# Altium project HV Box Connector Board.PrjPcb
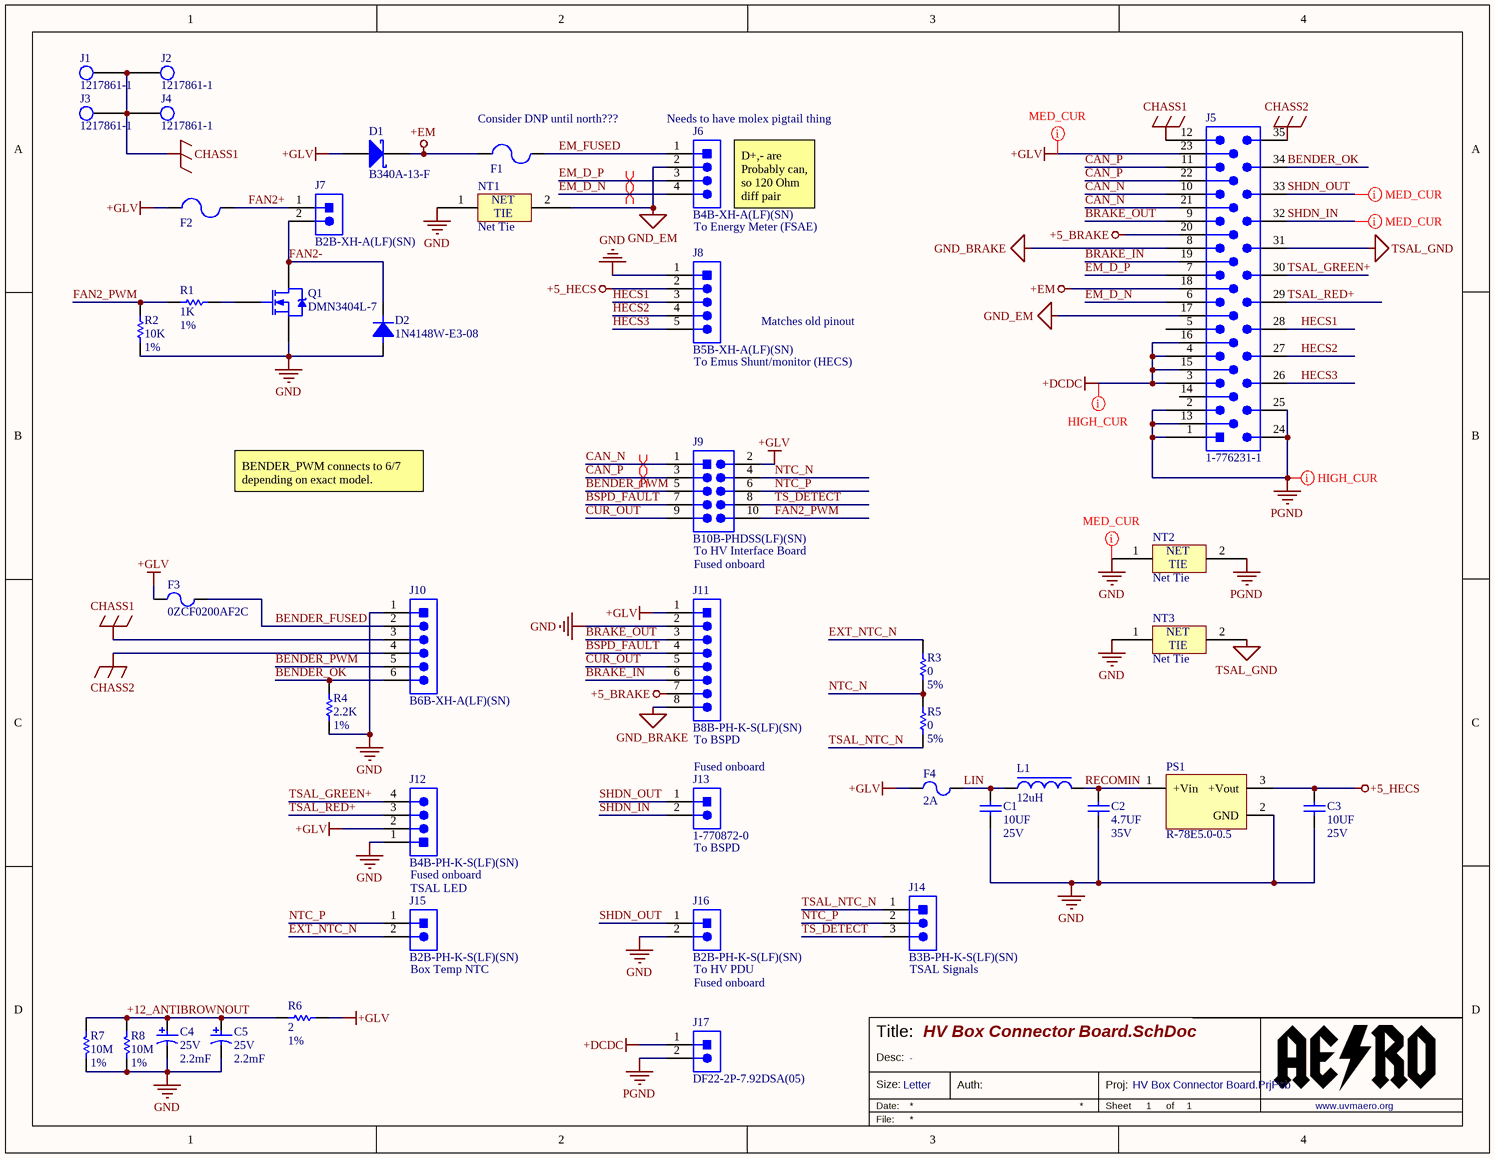
[diagram p0: HV Box Connector Board.SchDoc]

1 sheet, 42 parts. Net scope: hierarchical (ports join the sheet entries above them; power ports are global).
Board file: HV Box Connector Board.PcbDoc

## Sheet HV Box Connector Board.SchDoc
size Letter; DocumentNumber: 1; SheetNumber: 1; SheetTotal: 1; DescLong2_DescShort: -

### Parts
C1  Val: 10UF  Vol: 25V  [0603_CAP]  (hidden comment: CAP 0603 10UF 25V 20% X5R)
C2  Val: 4.7UF  Vol: 35V  [0603_CAP]  (hidden comment: CAP 0603 4.7UF 35V 10% X5R)
C3  Val: 10UF  Vol: 25V  [0603_CAP]  (hidden comment: CAP 0603 10UF 25V 20% X5R)
C4  Voltage Rating (DC): 25V  Capacitance: 2.2mF  [Nichicon_18x15]  (hidden comment: URS1E222MHD)
C5  Voltage Rating (DC): 25V  Capacitance: 2.2mF  [Nichicon_18x15]  (hidden comment: URS1E222MHD)
D1  B340A-13-F  [DIOD-SMA-2_V]
D2  1N4148W-E3-08  [Vishay_1N4148W-E3-08]
F1  NANOSMDC050F/13.2-2  [1206_FUSE_40H]  (value not drawn)
F2  NANOSMDC050F/13.2-2  [1206_FUSE_40H]  (value not drawn)
F3  0ZCF0200AF2C  [Bel_0ZCF0200AF2C_0]
F4  Hold Current: 2A  [Bel_0ZCF0200AF2C_0]  (hidden comment: 0ZCF0200AF2C)
J1  1217861-1  [te-1217861-1]
J2  1217861-1  [te-1217861-1]
J3  1217861-1  [te-1217861-1]
J4  1217861-1  [te-1217861-1]
J5  1-776231-1  [TE_1-776231-1]
J6  B4B-XH-A(LF)(SN)  [B4B-XH-A(LF)(SN)]
J7  B2B-XH-A(LF)(SN)  [B2B-XH-A(LF)(SN)]
J8  B5B-XH-A(LF)(SN)  [JST_B5B-XH-A_LF_SN_0]
J9  B10B-PHDSS(LF)(SN)  [B10B-PHDSS]
J10  B6B-XH-A(LF)(SN)  [CONN_B6B-XH-A(LF]
J11  B8B-PH-K-S(LF)(SN)  [B8B-PH-K]
J12  B4B-PH-K-S(LF)(SN)  [B4B-PH-K]
J13  1-770872-0  [CON2_1X2_P163_VM]
J14  B3B-PH-K-S(LF)(SN)  [B3B-PH-K]
J15  B2B-PH-K-S(LF)(SN)  [JST_Sales_America_Inc._B2B-PH-K-S_LF_SN_0]
J16  B2B-PH-K-S(LF)(SN)  [JST_Sales_America_Inc._B2B-PH-K-S_LF_SN_0]
J17  DF22-2P-7.92DSA(05)  [DF22-2P-7.92DSA_05_0]
L1  Inductance: 12uH  [IND_1225AS-H-120M=P2]  (hidden comment: 1225AS-H-120M=P2)
NT1  Net Tie  [20MIL_TIE]  (net tie, no BOM)
NT2  Net Tie  [60MIL_TIE]  (net tie, no BOM)
NT3  Net Tie  [20MIL_TIE]  (net tie, no BOM)
PS1  R-78E5.0-0.5  [R-78E5.0]
Q1  DMN3404L-7  [SOT23-FET-DI]
R1  Val: 1K  Tol: 1%  [0603_RES]  (hidden comment: RES 0603 1K 1%)
R2  Val: 10K  Tol: 1%  [0603_RES]  (hidden comment: RES 0603 10K 1%)
R3  Val: 0  Tol: 5%  [0603_RES]  (hidden comment: RES 0603 0 5%)
R4  Val: 2.2K  Tol: 1%  [0603_RES]  (hidden comment: RES 0603 2.2K 1%)
R5  Val: 0  Tol: 5%  [0603_RES]  (hidden comment: RES 0603 0 5%)
R6  Val: 2  Tol: 1%  [1206_RES_28H]  (hidden comment: RES 1206 2 1%)
R7  Val: 10M  Tol: 1%  [0805_RES]  (hidden comment: RES 0805 10M 1%)
R8  Val: 10M  Tol: 1%  [0805_RES]  (hidden comment: RES 0805 10M 1%)

### Nets
+5_BRAKE: J5.20 J11.7
+5_HECS: C3.2 J8.2 PS1.3(+Vout)
+DCDC: J5.3 J5.4 J5.15 J5.16 J17.1
+EM: D1.2(K) F1.1 J5.18
+GLV: D1.1(A) F2.1 F3.1 F4.1 J5.23 J9.2 J11.1 J12.2 R6.2
CHASS1: J1.1a J1.1b J1.1c J2.1a J2.1b J2.1c J3.1a J3.1b J3.1c J4.1a J4.1b J4.1c J5.12 J10.3
CHASS2: J5.35 J10.4
GND: C1.1 C2.1 C3.1 C4.2 C5.2 D2.A J8.1 J10.1 J11.2 J12.1 J16.2 NT1.1 NT2.1 NT3.1 PS1.2(GND) Q1.2(S) R2.1 R4.2 R7.1 R8.1
GND_BRAKE: J5.8 J11.8
GND_EM: J5.17 J6.2 NT1.2
PGND: J5.1 J5.2 J5.13 J5.24 J5.25 J17.2 NT2.2
TSAL_GND: J5.31 NT3.2
+12_ANTIBROWNOUT: C4.1 C5.1 R6.1 R7.2 R8.2
BENDER_FUSED: F3.2 J10.2
BENDER_OK: J5.34 J10.6 R4.1
BENDER_PWM: J9.5 J10.5
BRAKE_IN: J5.19 J11.6
BRAKE_OUT: J5.9 J11.3
BSPD_FAULT: J9.7 J11.4
CAN_N: J5.10 J5.21 J9.1
CAN_P: J5.11 J5.22 J9.3
CUR_OUT: J9.9 J11.5
EM_D_N: J5.6 J6.4
EM_D_P: J5.7 J6.3
EM_FUSED: F1.2 J6.1
EXT_NTC_N: J15.2 R3.2
FAN2+: F2.2 J7.1
FAN2-: D2.K J7.2 Q1.3(D)
FAN2_PWM: J9.10 R1.1 R2.2
HECS1: J5.28 J8.3
HECS2: J5.27 J8.4
HECS3: J5.26 J8.5
LIN: C1.2 F4.2 L1.1
NTC_N: J9.4 R3.1 R5.2
NTC_P: J9.6 J14.2 J15.1
RECOMIN: C2.2 L1.2 PS1.1(+Vin)
SHDN_IN: J5.32 J13.2
SHDN_OUT: J5.33 J13.1 J16.1
TS_DETECT: J9.8 J14.3
TSAL_GREEN+: J5.30 J12.4
TSAL_NTC_N: J14.1 R5.1
TSAL_RED+: J5.29 J12.3
NetQ1_1: Q1.1(G) R1.2

Not connected (* = marked no-connect by the designer): J5 5 14

### Layout directives
differential pair; differential pair class CAN: CAN_N, CAN_P, EM_D_N, EM_D_P
net class MED_CUR: +GLV, GND, SHDN_IN, SHDN_OUT
net class HIGH_CUR: +DCDC, PGND

### Notes on the sheet
- (near F1) Consider DNP until north???
- (near J6) Needs to have molex pigtail thing
- To Energy Meter (FSAE)
- (near J6) D+,- are Probably can, so 120 Ohm diff pair
- (near J8) To Emus Shunt/monitor (HECS)
- Matches old pinout
- BENDER_PWM connects to 6/7 depending on exact model.
- (near J9) To HV Interface Board
- Fused onboard
- (near J11) To BSPD
- (near J13) Fused onboard
- TSAL LED
- (near J13) To BSPD
- (near J15) Box Temp NTC
- (near J16) To HV PDU
- (near J14) TSAL Signals
- Title:
- Size:
- Date:
- Desc:
- Letter
- Auth:
- Sheet
- Proj:
- of
- www.uvmaero.org
- File:
- (in symbol NET TIE) NET; TIE

### Library data of the parts
C1 C3 = CAP 0603 10UF 25V 20% X5R: Capacitor Surface Mount 0603 Footprint 10UF 25V 20% Tolerance Ceramic X5R; Manufacturer: Various; PCB Package: 0603; Description in Visual: Cap SMT 0603 10UF 25V 20% Ceramic X5R; P/N: CAP 0603 10UF 25V 20% X5R; Manufacturer P/N: Various; Value: 10UF; Voltage: 25V; Tolerance: 20%; Type: Ceramic X5R; ComponentLink1Description: Manufacturer Website; ComponentLink2Description: Component Datasheet; ComponentLink3Description: Octopart Link
C2 = CAP 0603 4.7UF 35V 10% X5R: Capacitor Surface Mount 0603 Footprint 47UF 35V 10% Tolerance Ceramic X5R; Manufacturer: Various; PCB Package: 0603; P/N: CAP 0603 4.7UF 35V 10% X5R; Manufacturer P/N: Various; Description in Visual: CAP 0603 4.7UF 35V 10% X5R; Value: 4.7UF; Voltage: 35V; Tolerance: 10%; Type: Ceramic X5R; ComponentLink1Description: Manufacturer Website; ComponentLink2Description: Component Datasheet; ComponentLink3Description: Octopart Link
C4 C5 = URS1E222MHD: 2200µF 25V Aluminum Electrolytic Capacitors Radial, Can  2000 Hrs @ 85°C; Manufacturer: Nichicon; Dielectric Material: Aluminium; Dissipation Factor: 0.16%; Lead Diameter: 0.8mm; Leakage Current: 1.65mA; Life (Hours): 2000Hour; Ripple Current: 1.36A; Tolerance: 20%; Case/Package: Radial; Category: Aluminum Electrolytic Capacitors; Diameter: 18mm; Height: 15mm; Height - Seated (Max): 0.65inch; Lead Free: Lead Free; Lead Pitch: 7.5mm; Length: 15mm; Manufacturer Part Number: URS1E222MHD; Max Operating Temperature: 85°C; Min Operating Temperature: -40°C; Mount: Through Hole; Number of Pins: 2; Package Quantity: 50; Packaging: Bulk; Radiation Hardening: No; Termination: Radial; Voltage Rating: 25V; Supplier 1: Digi-Key; Supplier Part Number 1: 493-15903-ND
D1 = CMP-1667-00003-1: Surface Mount Schottky Barrier Rectifier, 40 V, 3 A, -55 to 150 degC, 2-Pin SMA, RoHS, Tape and Reel; Forward Current: 3 A; Forward Voltage: 500 mV; Max Surge Current: 80 A; Peak Reverse Current: 500 uA; Elements: 1; Mounting Technology: Surface Mount; ComponentLink1URL: http://www.diodes.com/; PackageDescription: 2-Pin Surface Mounted Assembly, Body 4.3 x 2.605 mm, Height 2.4 mm; Min Operating Temperature: -55 degC; Mount: Surface Mount; Pins: 2; ComponentLink2URL: http://www.diodes.com/_files/datasheets/ds30891.pdf; PackageReference: SMA-2; Max Operating Temperature: 125 degC; Radiation Hardening: No; Length: 4.6 mm; RoHSCompliant: true; ComponentLink1Description: Manufacturer URL; Height: 2.1 mm; ComponentLink2Description: Datasheet; Packaging: Tape and Reel; Package Quantity: 5000; Case\Package: SMA; DatasheetVersion: Rev. 17 - 2, 09/2015; REACH SVHC: No SVHC; Width: 2.92 mm
D2 = 1N4148W-E3-08: Diode Standard 75V 150mA Surface Mount SOD-123; Manufacturer: Vishay; Element Configuration: Single; Forward Voltage: 1.2V; Max Forward Surge Current (Ifsm): 2A; Max Power Dissipation: 350mW; Max Repetitive Reverse Voltage (Vrrm): 100V; Max Reverse Leakage Current: 5uA; Peak Reverse Current: 100uA; Recovery Time: 4ns; Average Rectified Current: 150mA; Category: Rectifier Diodes; Contact Plating: Tin; Forward Current: 150mA; Height: 1.25mm; Lead Free: Lead Free; Length: 2.85mm; Manufacturer Part Number: 1N4148W-E3-08; Max Operating Temperature: 150°C; Max Reverse Voltage (DC): 75V; Max Surge Current: 2A; Min Operating Temperature: -55°C; Mount: Surface Mount; Number of Pins: 2; Package Quantity: 3000; Packaging: Tape and Reel; Peak Non-Repetitive Surge Current: 2A; Power Dissipation: 350mW; Radiation Hardening: No; REACH SVHC: Unknown; Reverse Recovery Time: 4ns; Weight: 0.000363oz; Width: 1.7mm; Supplier 1: Allied Electronics; Supplier Part Number 1: 70798350
F1 F2 = NANOSMDC050F/13.2-2: 610 mA 13.2 VDC PTC resettable fuse 1206 footprint; Manufacturer: Tyco; Description in Visual: Fuse Resettable SMT 610mA 13.2VDC 1206; Hold Current (mA): 610; Trip Current (mA): 1240; Max Current (A): 100; Max Voltage (V): 13.2; Time to Trip (sec): 0.1; Resistance (min) (Ohms): 0.2; Resistance (max) (Ohms): 0.8; PCB Package: 1206; P/N: NANOSMDC050F/13.2-2; Manufacturer P/N: NANOSMDC050F/13.2-2; ComponentLink1Description: Manufacturer Website; ComponentLink1URL: http://www.te.com.com; ComponentLink2Description: Component Datasheet; ComponentLink2URL: http://www.te.com/commerce/DocumentDelivery/DDEController?Action=showdoc&DocId=Catalog+Section%7FSURFACE-MOUNT%7FA1%7Fpdf%7FEnglish%7FENG_CS_SURFACE-MOUNT_A1.pdf%7FRF1411-000; ComponentLink3Description: Octopart Link; ComponentLink3URL: http://octopart.com/partsearch/#search/requestData&q=NANOSMDC050F/13.2-2
F3 F4 = 0ZCF0200AF2C: Polymeric PTC Resettable Fuse 24V 2A Ih Surface Mount 2920 (7351 Metric), Concave; Manufacturer: Bel; Max Current Rating: 40A; Time to Trip: 5s; Trip Current: 4A; Case Code (Imperial): 2920; Case Code (Metric): 7351; Category: PTC Resettable Fuses; Lead Free: Lead Free; Manufacturer Part Number: 0ZCF0200AF2C; Package Quantity: 1; Packaging: Cut Tape; Supplier 1: Digi-Key; Supplier Part Number 1: 507-1749-1-ND
  F3: Hold Current: 2A
J1-J4 = 1217861-1: CONN TAB .250 STR QC TIN PCB; Gender: Male; Hole Diameter: 0.055inch; Insulation: Non-Insulated; Tab Length: 0.352inch; Tab Thickness: 0.032inch; Tab Width: 0.25inch; PCB Thickness: 0.062inch; Body Material: Brass; Insulated Wire Support: Yes; Contact Material: Brass; Contact Plating: Tin; ELV: Compliant; Length: 0.552inch; Material: Brass; Mount: Through Hole; Package Quantity: 2000; Packaging: Tape and Reel; Termination: Tab; Mating Tab Width: 0.25inch; Body Plating: Tin; Depth: 7.92mm; Plating: Tin; REACH SVHC: Unknown; Terminal Material: Brass; Lead Free: Lead Free; Supplier 1: Digi-Key; Supplier Part Number 1: A100452CT-ND
J5 = 1-776231-1: Connector Header Panel Mount, Through Hole 35 position 0.157" (4.00mm); Manufacturer: TE Connectivity; Circuit Application: Power; Connector System: Wire-to-Device; Connector Type: Male Pin; Gender: Male; Max Voltage Rating (AC): 250V; Number of Contacts: 35; Number of Ports: 1; PCB Mount Alignment: Yes (With); PCB Mount Retention: Without; PCB Thickness: 0.062inch; Pitch: 0.157inch; Shielding: Unshielded; Tab Thickness: 1.3mm; Category: Headers and Wire Housings; Color: Black; Contact Material: Brass; Contact Plating: Gold; Depth: 32.1mm; Fastening Type: Ramp; Flammability Rating: UL94 V-0; Housing Material: Thermoplastic; Length: 3.03inch; Manufacturer Part Number: 1-776231-1; Max Operating Temperature: 125°C; Min Operating Temperature: -40°C; Mount: Through Hole,Panel; Number of Positions: 35; Number of Rows: 3; Number of Signal Positions: 35; Number of Terminals: 35; Orientation: Straight; Package Quantity: 220; Packaging: Bulk; Radiation Hardening: No; Row Spacing: 0.157inch; Sealable: Yes (With); Termination: Solder; Width: 1.264inch; Supplier 1: Digi-Key; Supplier Part Number 1: A104915-ND
J6 = B4B-XH-A(LF)(SN): Connector Header Through Hole 4 position 0.098" (2.50mm); Manufacturer: JST; No of Positions: 4; Style/Orientation: StraightHeader/Plug; Type: ShroudedHeader; Manufacturer URL: http://www.jst.com/home2.html; Termination: Crimp; Datasheet Version: Apr-09; Supplier 1: Newark; Supplier Part Number 1: 73M9436
J7 = B2B-XH-A(LF)(SN): CONN HEADER VERT 2POS 2.5MM; Manufacturer: JST; Connector Type: Male Pin; Contact Resistance: 20mR; Current Rating: 3A; Insulation Resistance: 1GR; Max Voltage Rating (AC): 250V; Number of Contacts: 2; Wire/Cable Gauge: 22AWG; Category: FFC / FPC; Color: Natural; Contact Material: Brass; Contact Plating: Tin,Copper,Lead; Depth: 5.75mm; Fastening Type: Detent; Housing Color: White; Housing Material: Polyamide; Lead Free: Lead Free; Lead Pitch: 2.5mm; Length: 7.4mm; Manufacturer Part Number: B2B-XH-A(LF)(SN); Max Current Rating: 3A; Max Operating Temperature: 85°C; Max Voltage Rating (DC): 250V; Min Operating Temperature: -25°C; Mount: Through Hole; Number of Positions: 2; Number of Rows: 1; Orientation: Straight; Packaging: Bulk; Pitch: 2.5mm; REACH SVHC: No SVHC; Termination: Solder; Voltage Rating: 250V; Voltage Rating (AC): 250V; Supplier 1: Newark; Supplier Part Number 1: 73M9415
J8 = B5B-XH-A(LF)(SN): Connector Header Through Hole 5 position 0.098" (2.50mm); Manufacturer: JST; Connector Type: Male Pin; Contact Resistance: 20mR; Current Rating: 3A; Gender: Male; Insulation Resistance: 1GR; Max Voltage Rating (AC): 250V; Number of Contacts: 5; Pitch: 2.5mm; Wire/Cable Gauge: 22AWG; Category: Headers and Wire Housings; Color: Natural; Contact Material: Brass; Contact Plating: Tin,Lead,Copper; Depth: 5.75mm; Fastening Type: Detent; Housing Color: White; Housing Material: Polyamide; Lead Free: Lead Free; Lead Pitch: 2.5mm; Length: 14.9mm; Manufacturer Part Number: B5B-XH-A(LF)(SN); Max Current Rating: 3A; Max Operating Temperature: 85°C; Min Operating Temperature: -25°C; Mount: Through Hole; Number of Positions: 5; Number of Rows: 1; Orientation: Straight; Packaging: Bulk; REACH SVHC: No SVHC; Termination: Press-Fit; Voltage Rating: 250V; Voltage Rating (AC): 250V; Supplier 1: Newark; Supplier Part Number 1: 73M9437
J9 = B10B-PHDSS(LF)(SN): Connector Header Through Hole 10 position 0.079" (2.00mm); Manufacturer: JST; Connector Type: Male Pin; Contact Resistance: 20mR; Current Rating: 3A; Gender: Male; Max Voltage Rating (AC): 250V; Number of Contacts: 10; Pitch: 2mm; Row Spacing: 0.079inch; Width: 5mm; Category: Headers and Wire Housings; Color: Natural; Contact Material: Copper Alloy,Tin; Contact Mating Length: 0.114inch; Contact Plating: Tin,Copper; Depth: 5mm; Fastening Type: Detent; Height: 9.5mm; Housing Color: Beige; Housing Material: Polyamide; Lead Free: Lead Free; Length: 11.9mm; Manufacturer Part Number: B10B-PHDSS(LF)(SN); Max Current Rating: 3A; Max Operating Temperature: 85°C; Max Voltage Rating (DC): 250V; Min Operating Temperature: -25°C; Mount: Through Hole; Number of Positions: 10; Number of Rows: 2; Orientation: Straight; Packaging: Bulk; Termination: Solder; Supplier 1: Digi-Key; Supplier Part Number 1: 455-1762-ND
J10 = B6B-XH-A(LF)(SN): Connector Header Through Hole 6 position 0.098" (2.50mm); Manufacturer: JST; Manufacturer Part Number: B6BXHA(LF)(SN); Connector Type: Male Pin; Contact Resistance: 20mR; Current Rating: 3A; Insulation Resistance: 1GR; Max Voltage Rating (AC): 250V; Number of Contacts: 6; Pitch: 2.5mm; Wire/Cable Gauge: 22AWG; Category: FFC / FPC; Color: Natural; Contact Material: Brass; Contact Plating: Tin,Lead,Copper; Depth: 5.75mm; Housing Color: White; Housing Material: Polyamide; Lead Free: Lead Free; Lead Pitch: 2.5mm; Length: 17.4mm; Max Current Rating: 3A; Max Operating Temperature: 85°C; Max Voltage Rating (DC): 250V; Min Operating Temperature: -25°C; Mount: Through Hole; Number of Positions: 6; Number of Rows: 1; Orientation: Straight; Package Quantity: 500; Packaging: Bulk; REACH SVHC: No SVHC; Termination: Press-Fit; Voltage Rating: 250V; Voltage Rating (AC): 250V; Supplier 1: Digi-Key; Supplier Part Number 1: 455-2271-ND
J11 = B8B-PH-K-S(LF)(SN): Connector Header Through Hole 8 position 0.079" (2.00mm); Supplier 1: Digi-Key; Supplier Part Number 1: 455-1710-ND
J12 = B4B-PH-K-S(LF)(SN): Male Header, Pitch 2 mm, 1 x 4 Position, Height 6 mm, Tail Length 3.4 mm, -25 to 85 degC, RoHS, Bulk; Manufacturer: JST; No of Positions: 4; Style/Orientation: StraightHeader/Plug; Pitch: 2mm; Datasheet URL: http://datasheet.octopart.com/B4B-PH-K-S%28LF%29%28SN%29-JST-datasheet-10558886.pdf; Type: ShroudedHeader; Manufacturer URL: http://www.jst.com/home2.html; Termination: Crimp; Datasheet Version: Apr-09; Supplier 1: Newark; Supplier Part Number 1: 37K9958
J13 = 1-770872-0: Connector Header Through Hole 2 position 0.163" (4.14mm); Vendor: TE Connectivity; Built_By: EMA_UL_Team; Approvals: CSA; Circuit Application: Power; Connector System: Wire-to-Board; Connector Type: Pin; Contact Current Rating: 9.5A; Contact Retention: No (Without); Gender: Male; Mating Alignment: Yes (With); Max Voltage Rating (AC): 600V; Number of Circuits: 2; Number of Ports: 1; PCB Mount Retention: With; PCB Mounting Orientation: Vertical; PCB Thickness: 0.062mm; Pitch: 0.162inch; Plating Thickness: 150um; VDE Tested: Yes; Manufacturer_Part_Number: 1-770872-0; Copyright: Copyright (C) 2018 Accelerated Designs. All rights reserved; RefDes: RefDes; Type: DEV; Value: Value; Supplier 1: Digi-Key; Supplier Part Number 1: A32449-ND; Category: Connectors; Color: White; Contact Gender: Male; Contact Material: Brass; Contact Plating: Tin; Current Rating: 9.5A; Depth: 6.35mm; ELV: Compliant; Fastening Type: Ramp; Flammability Rating: UL94 V-0; Height: 13.49mm; Housing Color: White; Housing Material: Nylon; Lead Free: Lead Free; Length: 9.83mm; Manufacturer: TE Connectivity; Manufacturer Part Number: 1-770872-0; Mating Retention: Yes (With); Max Operating Temperature: 221°C; Min Operating Temperature: -67°C; Mount: Through Hole; Number of Contacts: 2; Number of Positions: 2; Number of Power Positions: 2; Number of Rows: 1; Number of Terminals: 2; Orientation: Straight; Package Quantity: 200; Packaging: Bag; PCB Mount Alignment: No (Without); Radiation Hardening: No; REACH SVHC: Unknown; Sealable: No (Without); Strain Relief: No (Without); Termination: Solder; Voltage Rating: 600V; Width: 9.83mm
J14 = B3B-PH-K-S(LF)(SN): Connector Header Through Hole 3 position 0.079" (2.00mm); Manufacturer: JST; Connector Type: Male Pin; Contact Resistance: 20mR; Current Rating: 2A; Gender: Male; Insulation Resistance: 1MR; Max Voltage Rating (AC): 100V; Number of Contacts: 3; Pitch: 2mm; Category: Headers and Wire Housings; Color: Natural; Contact Material: Brass,Tin; Contact Mating Length: 0.13inch; Contact Plating: Tin,Copper; Depth: 4.5mm; Fastening Type: Detent; Height: 9.4mm; Housing Color: White; Housing Material: Polyamide; Lead Free: Lead Free; Lead Pitch: 2mm; Length: 7.9mm; Manufacturer Part Number: B3B-PH-K-S(LF)(SN); Max Current Rating: 2A; Max Operating Temperature: 85°C; Max Voltage Rating (DC): 100V; Min Operating Temperature: -25°C; Mount: Through Hole; Number of Pins: 3; Number of Poles: 3; Number of Positions: 3; Number of Rows: 1; Orientation: Straight; Packaging: Bulk; REACH SVHC: No SVHC; Termination: Solder; Voltage Rating: 100V; Voltage Rating (AC): 100V; Width: 4.5mm; Working Voltage: 100V; Supplier 1: Arrow; Supplier Part Number 1: B3B-PH-K-S (LF)(SN)
J15 J16 = B2B-PH-K-S(LF)(SN): Connector Header Through Hole 2 position 0.079" (2.00mm); Manufacturer: JST; Manufacturer Part Number: B2BPHKSLFSN; Connector Type: Male Pin; Contact Resistance: 20mR; Current Rating: 2A; Gender: Male; Insulation Resistance: 1MR; Max Voltage Rating (AC): 100V; Number of Contacts: 2; Pitch: 2mm; Category: Connectors; Color: Natural; Contact Material: Brass,Tin; Contact Mating Length: 0.13inch; Contact Plating: Tin,Copper; Depth: 4.5mm; Fastening Type: Detent; Height: 9.4mm; Housing Color: White; Housing Material: Polyamide; Lead Free: Lead Free; Lead Pitch: 2mm; Length: 5.9mm; Max Current Rating: 2A; Max Operating Temperature: 85°C; Max Voltage Rating (DC): 100V; Min Operating Temperature: -25°C; Mount: Through Hole; Number of Pins: 2; Number of Poles: 2; Number of Positions: 2; Number of Rows: 1; Orientation: Straight; Packaging: Bulk; REACH SVHC: No SVHC; Termination: Solder; Voltage Rating: 100V; Voltage Rating (AC): 100V; Width: 4.5mm; Working Voltage: 100V; Supplier 1: Newark; Supplier 2: Digi-Key; Supplier Part Number 1: 37K9940; Supplier Part Number 2: 455-1704-ND
J17 = DF22-2P-7.92DSA(05): Connector Header Through Hole 2 position 0.312" (7.92mm); Manufacturer: Hirose; Connector Type: Male Pin; Contact Resistance: 5mR; Current Rating: 25A; Gender: Male; Max Voltage Rating (AC): 1kV; Number of Contacts: 2; Voltage Rating: 600V; Category: Headers and Wire Housings; Color: Beige; Contact Material: Copper Alloy; Contact Mating Length: 0.354inch; Contact Plating: Copper,Tin,Lead; Depth: 12.45mm; Housing Color: Natural; Housing Material: Polyamide; Lead Free: Lead Free; Length: 17.22mm; Manufacturer Part Number: DF22-2P-7.92DSA(05); Max Operating Temperature: 85°C; Min Operating Temperature: -35°C; Mount: Through Hole; Number of Positions: 2; Number of Rows: 1; Orientation: Straight; Package Quantity: 100; Packaging: Bulk; Pitch: 7.92mm; Radiation Hardening: No; REACH SVHC: Unknown; Termination: Solder; Supplier 1: Digi-Key; Supplier Part Number 1: H10714-ND
L1 = 1225AS-H-120M=P2: 1µH Shielded Wirewound Inductor 15A 4.6mOhm Nonstandard; Manufacturer: Murata; Core Material: Ferrite; Current Rating: 760mA; DC Resistance (DCR): 350mR; Saturation Current: 550mA; Test Frequency: 100kHz; Tolerance: 20%; Case/Package: Nonstandard; Category: Fixed Inductors; Composition: Wirewound; Height - Seated (Max): 0.047inch; Length: 0.126inch; Manufacturer Part Number: 1225AS-H-120M=P2; Max Operating Temperature: 85°C; Min Operating Temperature: -40°C; Mount: Surface Mount; Packaging: Cut Tape; Shielding: Shielded; Width: 0.118inch; Supplier 1: Digi-Key; Supplier Part Number 1: 490-14147-1-ND
NT1-NT3 = NET TIE: Net Tie (No BOM)
PS1 = R-78E5.0-0.5: IC Linear Regulator Replacement DC DC Converter 1 Output 5V 500mA 7V - 28V Input; Manufacturer: RECOM; Efficiency: 82-92% typ.; Input Voltage Range: 7V ~ 28V; Library Path1: parts/IC_RECOM_R-78E5.0-0.5_eec.SchLib; Max# Capacitive Load: 220µF; Part Number: R-78E5.0-0.5; Datasheet Path: datasheets/IC_RECOM_R-78E5.0-0.5_eec.pdf; ComponentLink1Description: Upverter; ComponentLink1URL: https://upverter.com/upn/revision/5351fc0564b0b61a/; ComponentLink2Description: Datasheet; ComponentLink2URL: https://www.recom-power.com/pdf/Innoline/R-78Exx-0.5.pdf; Datasheet Path1: datasheets/IC_RECOM_R-78E5.0-0.5_eec.pdf; Digikey Description: IC Linear Regulator Replacement DC DC Converter 1 Output 5V 500mA 7V - 28V Input; Digikey Part Number: 945-1648-5-ND; Lead Free: yes; Library Ref1: R-78E5.0-0.5; Mouser Part Number: 919-R-78E5.0-0.5; Output Current: 500mA; Output Voltage: 5V; Package: SIP-3; Price: 2.52764935796; RoHS: TRUE; Supplier 1: Digi-Key; Supplier 2: Mouser; Supplier Part Number 1: 945-1648-5-ND; Supplier Part Number 2: 919-R-78E5.0-0.5; Temperature: -40°C to +85°C; Temperature Range High: +85°C; Temperature Range Low: -40°C; helpURL: https://upverter.com/upn/revision/5351fc0564b0b61a/
Q1 = DMN3404L-7: N-Channel 30V 5.8A (Ta) 720mW (Ta) Surface Mount SOT-23-3; Manufacturer: Diodes; Drain to Source Resistance: 82mR; Element Configuration: Single; Fall Time: 6.18ns; Gate to Source Voltage (Vgs): 20V; Input Capacitance: 386pF; Max Power Dissipation: 1.4W; Nominal Vgs: 1.5V; Number of Channels: 1; On-State Resistance: 28mR; Turn-Off Delay Time: 13.92ns; Turn-On Delay Time: 3.41ns; Case/Package: SOT-23; Category: MOSFETs; Contact Plating: Tin,Matte; Continuous Drain Current (ID): 5.8A; Drain to Source Breakdown Voltage: 30V; Drain to Source Voltage (Vdss): 30V; Height: 1mm; Lead Free: Lead Free; Length: 2.9mm; Manufacturer Part Number: DMN3404L-7; Max Operating Temperature: 150°C; Min Operating Temperature: -55°C; Mount: Surface Mount; Number of Elements: 1; Number of Pins: 3; Package Quantity: 3000; Packaging: Tape and Reel; Power Dissipation: 1.4W; Rds On Max: 28mR; REACH SVHC: No SVHC; Rise Time: 6.18ns; Threshold Voltage: 1.5V; Weight: 0.000282oz; Width: 1.3mm; Supplier 1: Digi-Key; Supplier Part Number 1: DMN3404LDICT-ND
R1 = RES 0603 1K 1%: Resistor Surface Mount, 1K Ohms, 0603 Footprint, 1% Tolerance 0.1W; Manufacturer: Various; PCB Package: 0603; Description in Visual: Res SMT 1K 0603  1%  0.1W; P/N: RES 0603 1K 1%; Manufacturer P/N: Various; Value: 1K; Power_Rating: 0.1W; Tolerance: 1%
R2 = RES 0603 10K 1%: Resistor Surface Mount, 10K Ohms, 0603 Footprint, 1% Tolerance 0.1W; Manufacturer: Various; PCB Package: 0603; Description in Visual: Res SMT 10K 0603  1%  0.1W; P/N: RES 0603 10K 1%; Manufacturer P/N: Various; Value: 10K; Power_Rating: 0.1W; Tolerance: 1%
R3 R5 = RES 0603 0 5%: Resistor Surface Mount, 0 Ohms, 0603 Footprint, 5% Tolerance 0.1W; Manufacturer: Various; PCB Package: 0603; Description in Visual: Res SMT 0 0603  5%  0.1W; Value: 0; P/N: RES 0603 0 5%; Manufacturer P/N: Various; Power_Rating: 0.1W; Tolerance: 5%
R4 = RES 0603 2.2K 1%: Resistor Surface Mount, 2.2K Ohms, 0603 Footprint, 1% Tolerance 0.1W; Manufacturer: Various; PCB Package: 0603; Description in Visual: Res SMT 2.2K 0603  1%  0.1W; P/N: RES 0603 2.2K 1%; Manufacturer P/N: Various; Value: 2.2K; Power_Rating: 0.1W; Tolerance: 1%
R6 = RES 1206 2 1%: Resistor Surface Mount, 2 Ohms, 1206 Footprint, 1% Tolerance 0.25W; Manufacturer: Various; PCB Package: 1206; Description in Visual: Res SMT 2 1206  1%  0.25W; Value: 2; P/N: RES 1206 2 1%; Manufacturer P/N: Various; Power_Rating: 0.25W; Tolerance: 1%
R7 R8 = RES 0805 10M 1%: Resistor Surface Mount, 10M Ohms, 0805 Footprint, 1% Tolerance 0.125W; Manufacturer: Various; PCB Package: 0805; Description in Visual: Res SMT 10M 0805  1%  0.125W; P/N: RES 0805 10M 1%; Manufacturer P/N: Various; Value: 10M; Power_Rating: 0.125W; Tolerance: 1%

## Assembly variants
As-Built: not fitted R3